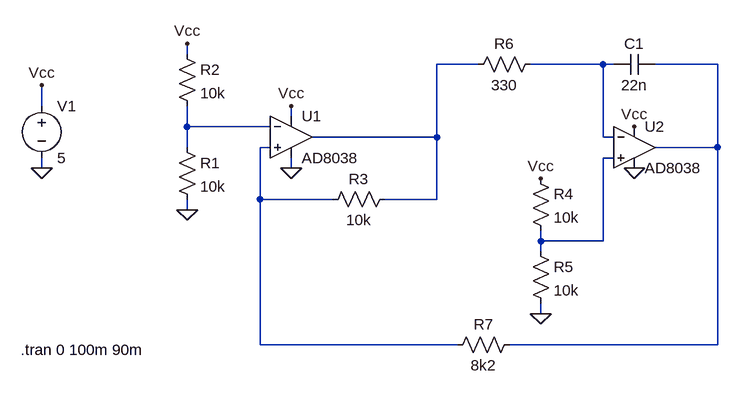
[diagram p0: schematic ramp_sandbox.asc]
ramp_sandbox.asc, the LTspice schematic file:
Version 4.1
SHEET 1 936 680
WIRE 112 0 112 -16
WIRE 560 16 496 16
WIRE 752 16 640 16
WIRE 768 16 752 16
WIRE 928 16 832 16
WIRE -112 80 -112 48
WIRE 272 96 272 80
WIRE 112 112 112 80
WIRE 240 112 112 112
WIRE 496 128 496 16
WIRE 496 128 304 128
WIRE 752 128 752 16
WIRE 768 128 752 128
WIRE 112 144 112 112
WIRE 240 144 224 144
WIRE 928 144 928 16
WIRE 928 144 832 144
WIRE 768 160 752 160
WIRE -112 176 -112 160
WIRE 272 176 272 160
WIRE 224 224 224 144
WIRE 336 224 224 224
WIRE 496 224 496 128
WIRE 496 224 416 224
WIRE 112 240 112 224
WIRE 656 288 656 272
WIRE 752 288 752 160
WIRE 752 288 656 288
WIRE 656 304 656 288
WIRE 656 400 656 384
WIRE 224 448 224 224
WIRE 528 448 224 448
WIRE 928 448 928 144
WIRE 928 448 608 448
FLAG 272 176 0
FLAG 272 80 Vcc
FLAG 112 240 0
FLAG 112 -16 Vcc
FLAG 656 400 0
FLAG 656 192 Vcc
FLAG 800 176 0
FLAG -112 176 0
FLAG -112 48 Vcc
FLAG 800 112 Vcc
SYMBOL res 96 128 R0
SYMATTR InstName R1
SYMATTR Value 10k
SYMBOL res 96 -16 R0
SYMATTR InstName R2
SYMATTR Value 10k
SYMBOL res 432 208 R90
WINDOW 0 0 56 VBottom 2
WINDOW 3 32 56 VTop 2
SYMATTR InstName R3
SYMATTR Value 10k
SYMBOL OpAmps\\AD8038 272 64 R0
SYMATTR InstName U1
SYMBOL OpAmps\\AD8038 800 80 R0
SYMATTR InstName U2
SYMBOL res 640 176 R0
SYMATTR InstName R4
SYMATTR Value 10k
SYMBOL res 640 288 R0
SYMATTR InstName R5
SYMATTR Value 10k
SYMBOL res 656 0 R90
WINDOW 0 0 56 VBottom 2
WINDOW 3 32 56 VTop 2
SYMATTR InstName R6
SYMATTR Value 330
SYMBOL res 624 432 R90
WINDOW 0 0 56 VBottom 2
WINDOW 3 32 56 VTop 2
SYMATTR InstName R7
SYMATTR Value 8k2
SYMBOL cap 832 0 R90
WINDOW 0 0 32 VBottom 2
WINDOW 3 32 32 VTop 2
SYMATTR InstName C1
SYMATTR Value 22n
SYMBOL voltage -112 64 R0
WINDOW 123 0 0 Left 0
WINDOW 39 0 0 Left 0
SYMATTR InstName V1
SYMATTR Value 5
TEXT -144 456 Left 2 !.tran 0 100m 90m

The netlist it stands for:
* ramp_sandbox.asc
R1 N004 0 10k
R2 Vcc N004 10k
R3 N001 N005 10k
X§U1 N005 N004 Vcc 0 N001 AD8038  ; pins In+ In- V+ V- OUT
X§U2 N006 N002 Vcc 0 N003 AD8038  ; pins In+ In- V+ V- OUT
R4 Vcc N006 10k
R5 N006 0 10k
R6 N002 N001 330
R7 N003 N005 8k2
C1 N003 N002 22n
V1 Vcc 0 5
.tran 0 100m 90m
.backanno
.end